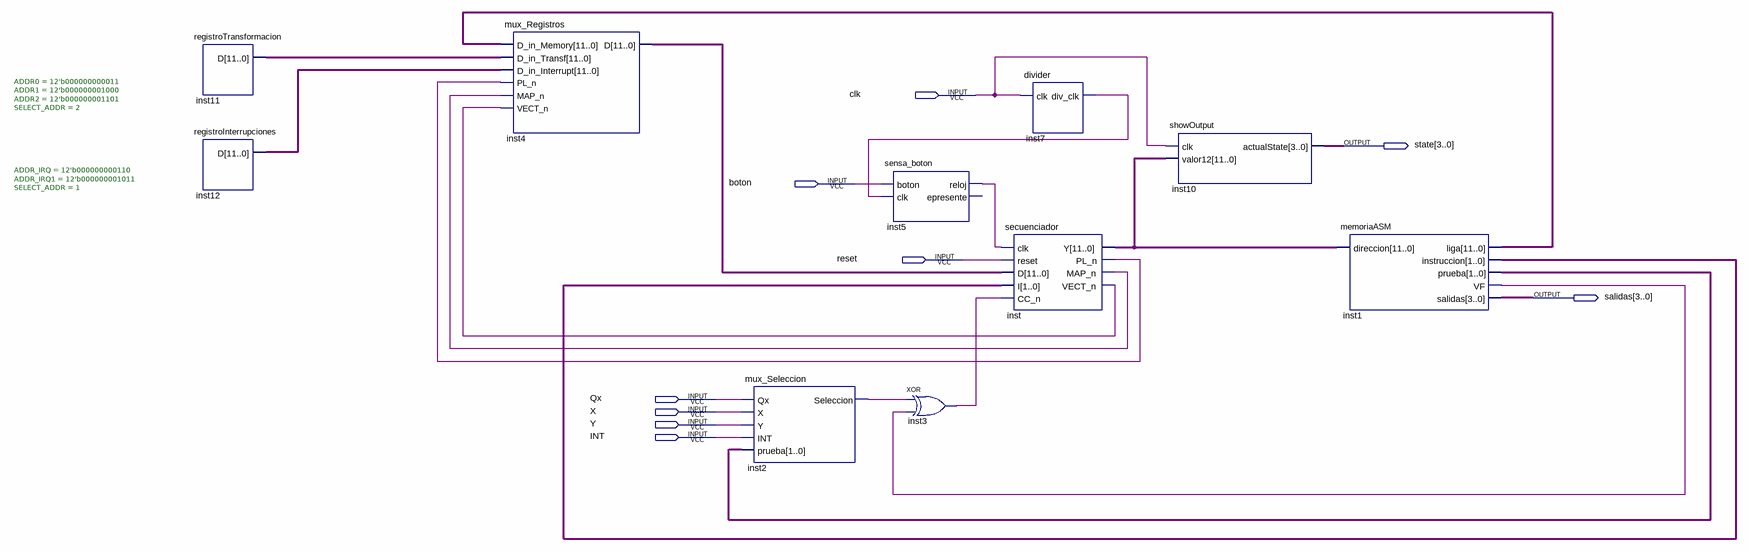
[diagram p0: schematic sheet]
// Quartus schematic practica4.bdf as structural Verilog: 10 symbols, 9 pins
module practica4 (
  input  clk,
  input  boton,
  input  reset,
  input  Qx,
  input  X,
  input  Y,
  input  INT,
  output [3:0] state,
  output [3:0] salidas
);

  wire inst1_vf, inst2_seleccion, inst3_out, inst5_reloj, inst7_div_clk, inst_map_n, inst_pl_n, inst_vect_n;
  wire [1:0] inst1_instruccion, inst1_prueba;
  wire [11:0] inst1_liga, inst4_d, inst11_d, inst12_d, inst_y;

  registroTransformacion #(.ADDR0(12'b000000000011), .ADDR1(12'b000000001000), .ADDR2(12'b000000001101), .SELECT_ADDR(2)) inst11 (.D(inst11_d));
  registroInterrupciones #(.ADDR_IRQ(12'b000000000110), .ADDR_IRQ1(12'b000000001011), .SELECT_ADDR(1)) inst12 (.D(inst12_d));
  mux_Registros inst4 (
    .D_in_Memory(inst1_liga), .D_in_Transf(inst11_d), .D_in_Interrupt(inst12_d), .PL_n(inst_pl_n),
    .MAP_n(inst_map_n), .VECT_n(inst_vect_n), .D(inst4_d));
  mux_Seleccion inst2 (.Qx(Qx), .X(X), .Y(Y), .INT(INT), .prueba(inst1_prueba), .Seleccion(inst2_seleccion));
  sensa_boton inst5 (.boton(boton), .clk(inst7_div_clk), .reloj(inst5_reloj));  // open: epresente
  xor inst3 (inst3_out, inst2_seleccion, inst1_vf);
  secuenciador inst (
    .clk(inst5_reloj), .reset(reset), .D(inst4_d), .I(inst1_instruccion), .CC_n(inst3_out), .Y(inst_y),
    .PL_n(inst_pl_n), .MAP_n(inst_map_n), .VECT_n(inst_vect_n));
  divider inst7 (.clk(clk), .div_clk(inst7_div_clk));
  showOutput inst10 (.clk(clk), .valor12(inst_y), .actualState(state));
  memoriaASM inst1 (
    .direccion(inst_y), .liga(inst1_liga), .instruccion(inst1_instruccion), .prueba(inst1_prueba),
    .VF(inst1_vf), .salidas(salidas));
endmodule
